# Altium schematic sheet Communication.SchDoc
size A4
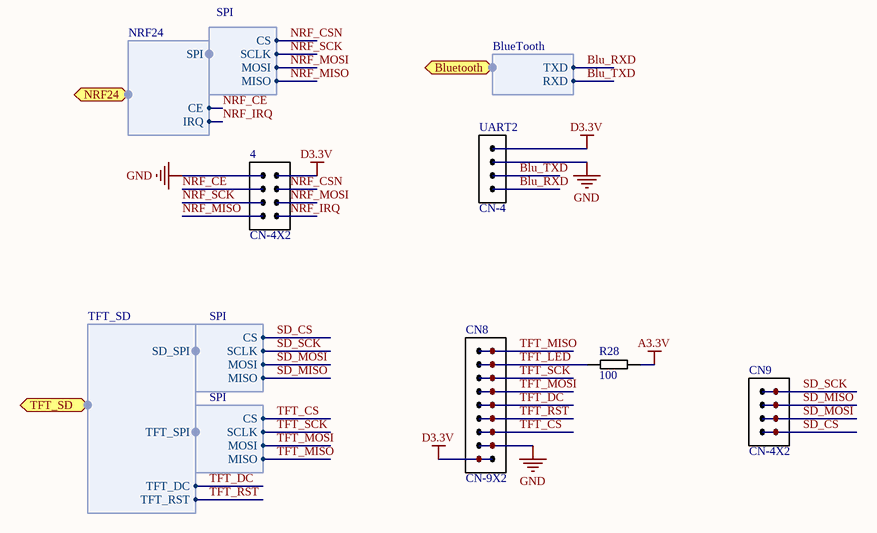
[diagram p0: Communication.SchDoc]

## Parts
4  CN-4X2  [IDC-8]
CN8  CN-9X2  [IDC-18]
CN9  CN-4X2  [IDC-8]
R28  100  [0805-R]
UART2  CN-4  [SIP-4]

## Ports
Bluetooth (harness BlueTooth), NRF24 (harness NRF24), TFT_SD (harness TFT_SD)

## Harnesses
NRF24: SPI, CE, IRQ
SPI: CS, SCLK, MOSI, MISO
BlueTooth: TXD, RXD
TFT_SD: SD_SPI, TFT_SPI, TFT_DC, TFT_RST

## Nets
A3.3V: R28.2
D3.3V: 4.2 CN8.17 CN8.18 UART2.1
GND: 4.1 CN8.15 CN8.16 UART2.2
Blu_RXD: UART2.4 ; port Bluetooth.TXD
Blu_TXD: UART2.3 ; port Bluetooth.RXD
NRF_CE: 4.3 ; port NRF24.CE
NRF_CSN: 4.4 ; harness SPI.CS
NRF_IRQ: 4.8 ; port NRF24.IRQ
NRF_MISO: 4.7 ; harness SPI.MISO
NRF_MOSI: 4.6 ; harness SPI.MOSI
NRF_SCK: 4.5 ; harness SPI.SCLK
SD_CS: CN9.7 CN9.8 ; harness SPI.CS
SD_MISO: CN9.3 CN9.4 ; harness SPI.MISO
SD_MOSI: CN9.5 CN9.6 ; harness SPI.MOSI
SD_SCK: CN9.1 CN9.2 ; harness SPI.SCLK
TFT_CS: CN8.13 CN8.14 ; harness SPI.CS
TFT_DC: CN8.9 CN8.10 ; port TFT_SD.TFT_DC
TFT_LED: CN8.3 CN8.4 R28.1
TFT_MISO: CN8.1 CN8.2 ; harness SPI.MISO
TFT_MOSI: CN8.7 CN8.8 ; harness SPI.MOSI
TFT_RST: CN8.11 CN8.12 ; port TFT_SD.TFT_RST
TFT_SCK: CN8.5 CN8.6 ; harness SPI.SCLK

## Library data of the parts
R28 = RES_Chip: 贴片